# Altium schematic sheet 4-Ethernet.SchDoc: Thermocouple Temperature Logger
size A4; Date: 14.03.2026; Author: MG & JK; Revision: 1-0; SheetNumber: 4; SheetTotal: 7; Model: Rev 1.0; PageSetup: Record=PageOptions|CenterHorizontal=True|CenterVertical=True|PrintScale=0.52|XCorrection=1.00|YCorrection=1.00|PrintKind=1|BorderSize=5000000|LeftOffset=0|BottomOffset=0|Orientation=2|PaperLength=4200|PaperWidth=2970|Scale=100|PaperSource=7|PrintQuality=600|MediaType=1|DitherType=10|PaperKind=A3|PrintScaleMode=1
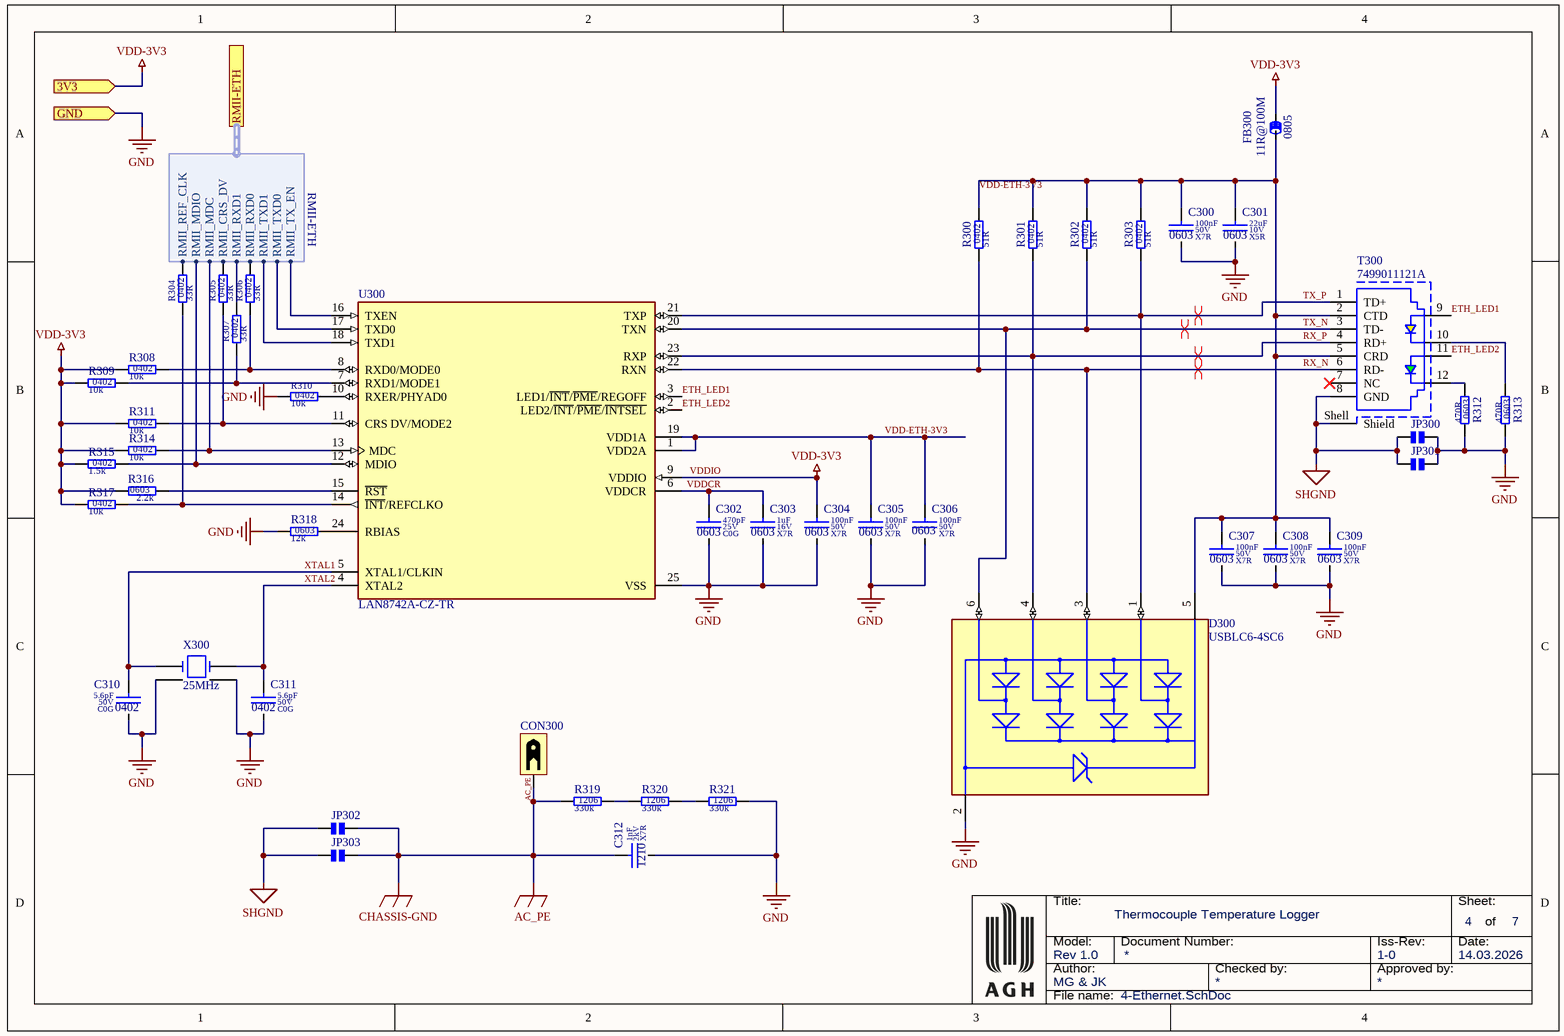
[diagram p0: 4-Ethernet.SchDoc]

## Parts
C300  value 100nF  Dielectric: X7R  Voltage: 50V  SCH_Footprint: 0603  [C_0603_1608]  (hidden comment: Ceramic X7R)
C301  value 22uF  Dielectric: X5R  Voltage: 10V  SCH_Footprint: 0603  [C_0603_1608]  (hidden comment: Ceramic X5R)
C302  value 470pF  Dielectric: C0G  Voltage: 25V  SCH_Footprint: 0603  [C_0603_1608]  (hidden comment: Ceramic C0G)
C303  value 1uF  Dielectric: X7R  Voltage: 16V  SCH_Footprint: 0603  [C_0603_1608]  (hidden comment: Ceramic X7R)
C304  value 100nF  Dielectric: X7R  Voltage: 50V  SCH_Footprint: 0603  [C_0603_1608]  (hidden comment: Ceramic X7R)
C305  value 100nF  Dielectric: X7R  Voltage: 50V  SCH_Footprint: 0603  [C_0603_1608]  (hidden comment: Ceramic X7R)
C306  value 100nF  Dielectric: X7R  Voltage: 50V  SCH_Footprint: 0603  [C_0603_1608]  (hidden comment: Ceramic X7R)
C307  value 100nF  Dielectric: X7R  Voltage: 50V  SCH_Footprint: 0603  [C_0603_1608]  (hidden comment: Ceramic X7R)
C308  value 100nF  Dielectric: X7R  Voltage: 50V  SCH_Footprint: 0603  [C_0603_1608]  (hidden comment: Ceramic X7R)
C309  value 100nF  Dielectric: X7R  Voltage: 50V  SCH_Footprint: 0603  [C_0603_1608]  (hidden comment: Ceramic X7R)
C310  value 5.6pF  Dielectric: C0G  Voltage: 50V  SCH_Footprint: 0402  [C_0402_1005]  (hidden comment: Ceramic C0G)
C311  value 5.6pF  Dielectric: C0G  Voltage: 50V  SCH_Footprint: 0402  [C_0402_1005]  (hidden comment: Ceramic C0G)
C312  value 1nF  Dielectric: X7R  Voltage: 2kV  SCH_Footprint: 1210  [C_1210_3225]  (hidden comment: Ceramic X7R)
CON300  Terminal for PE  [TP_1-726388-2]  (value not drawn)
D300  USBLC6-4SC6  [FP-SOT23-6L-MFG]
FB300  value 11R@100M  SCH_Footprint: 0805  [FB_0805_2012]  (hidden comment: Ferrite bead)
JP300  Solder Jumper 0603/1608  [JP_0603_1608]  (value not drawn)
JP301  Solder Jumper 0603/1608  [JP_0603_1608]  (value not drawn)
JP302  Solder Jumper 0603/1608  [JP_0603_1608]  (value not drawn)
JP303  Solder Jumper 0603/1608  [JP_0603_1608]  (value not drawn)
R300  value 51R  SCH_Footprint: 0402  [R_0402_1005]  (hidden comment: Resistor)
R301  value 51R  SCH_Footprint: 0402  [R_0402_1005]  (hidden comment: Resistor)
R302  value 51R  SCH_Footprint: 0402  [R_0402_1005]  (hidden comment: Resistor)
R303  value 51R  SCH_Footprint: 0402  [R_0402_1005]  (hidden comment: Resistor)
R304  value 33R  SCH_Footprint: 0402  [R_0402_1005]  (hidden comment: Resistor)
R305  value 33R  SCH_Footprint: 0402  [R_0402_1005]  (hidden comment: Resistor)
R306  value 33R  SCH_Footprint: 0402  [R_0402_1005]  (hidden comment: Resistor)
R307  value 33R  SCH_Footprint: 0402  [R_0402_1005]  (hidden comment: Resistor)
R308  value 10k  SCH_Footprint: 0402  [R_0402_1005]  (hidden comment: Resistor)
R309  value 10k  SCH_Footprint: 0402  [R_0402_1005]  (hidden comment: Resistor)
R310  value 10k  SCH_Footprint: 0402  [R_0402_1005]  (hidden comment: Resistor)
R311  value 10k  SCH_Footprint: 0402  [R_0402_1005]  (hidden comment: Resistor)
R312  value 470R  SCH_Footprint: 0603  [R_0603_1608]  (hidden comment: Resistor)
R313  value 470R  SCH_Footprint: 0603  [R_0603_1608]  (hidden comment: Resistor)
R314  value 10k  SCH_Footprint: 0402  [R_0402_1005]  (hidden comment: Resistor)
R315  value 1.5k  SCH_Footprint: 0402  [R_0402_1005]  (hidden comment: Resistor)
R316  value 2.2k  SCH_Footprint: 0603  [R_0603_1608]  (hidden comment: Resistor)
R317  value 10k  SCH_Footprint: 0402  [R_0402_1005]  (hidden comment: Resistor)
R318  value 12k  SCH_Footprint: 0603  [R_0603_1608]  (hidden comment: Resistor)
R319  value 330k  SCH_Footprint: 1206  [R_1206_3216]  (hidden comment: Resistor)
R320  value 330k  SCH_Footprint: 1206  [R_1206_3216]  (hidden comment: Resistor)
R321  value 330k  SCH_Footprint: 1206  [R_1206_3216]  (hidden comment: Resistor)
T300  7499011121A  [7499011121A]
U300  LAN8742A-CZ-TR  [FP-C04-143B-S4QFN-MFG]
X300  value 25MHz  [X_2x1.6_4PIN]  (hidden comment: 32 MHz Oscilator)

## Ports
3V3 (in, see 1-Block-diagram[4A], 2-STM32H563[2A], 3-Power-Supply[2D], 5-SD-Card[1A], 6-Connectors[1A]), GND (in, see 1-Block-diagram[4A], 2-STM32H563[2A], 3-Power-Supply[3A], 5-SD-Card[1A], 6-Connectors[1A], 7-LTC2983[1A]), RMII-ETH (harness RMII-ETH, see 1-Block-diagram[4A], 2-STM32H563[1A])

## Harnesses
RMII-ETH: RMII_TX_EN, RMII_TXD0, RMII_TXD1, RMII_RXD0, RMII_RXD1, RMII_CRS_DV, RMII_MDC, RMII_MDIO, RMII_REF_CLK

## Nets
AC_PE: C312.1 CON300.1(TP) JP302.2 JP303.2 R319.1  [also labelled CHASSIS-GND]
GND: C300.2 C301.2 C302.2 C303.2 C304.2 C305.2 C306.2 C307.2 C308.2 C309.2 C310.2 C311.2 C312.2 D300.2(GND) JP300.2 JP301.2 R310.1 R312.1 R313.1 R318.1 R321.2 U300.25(VSS) X300.2(GND) X300.4(GND) ; port GND
SHGND: JP300.1 JP301.1 JP302.1 JP303.1 T300.8(GND) T300.Shell(Shield)
VDDIO: C304.1 FB300.1 R308.1 R309.1 R311.1 R314.1 R315.1 R316.2 R317.1 U300.9(VDDIO) ; port 3V3  [also labelled VDD-3V3]
ETH_LED1: T300.9 U300.3(LED1/~{INT}/~{PME}/REGOFF)
ETH_LED2: T300.11 U300.2(LED2/~{INT}/~{PME}/~{INTSEL})
RX_N: D300.3(I/O2) R300.1 T300.6(RD-) U300.22(RXN)
RX_P: D300.4(I/O3) R301.1 T300.4(RD+) U300.23(RXP)
TX_N: D300.6(I/O4) R302.1 T300.3(TD-) U300.20(TXN)
TX_P: D300.1(I/O1) R303.1 T300.1(TD+) U300.21(TXP)
VDD-ETH-3V3: C300.1 C301.1 C305.1 C306.1 C307.1 C308.1 C309.1 D300.5(VBUS) FB300.2 R300.2 R301.2 R302.2 R303.2 T300.2(CTD) T300.5(CRD) U300.1(VDD2A) U300.19(VDD1A)
VDDCR: C302.1 C303.1 U300.6(VDDCR)
XTAL1: C310.1 U300.5(XTAL1/CLKIN) X300.3
XTAL2: C311.1 U300.4(XTAL2) X300.1
NetR304_1: R304.1 R317.2 U300.14(~{INT}/REFCLKO)
NetR304_2: R304.2 ; port RMII-ETH.RMII_REF_CLK
NetR305_1: R305.1 R311.2 U300.11(CRS_DV/MODE2)
NetR305_2: R305.2 ; port RMII-ETH.RMII_CRS_DV
NetR306_1: R306.1 R308.2 U300.8(RXD0/MODE0)
NetR306_2: R306.2 ; port RMII-ETH.RMII_RXD0
NetR307_1: R307.1 R309.2 U300.7(RXD1/MODE1)
NetR307_2: R307.2 ; port RMII-ETH.RMII_RXD1
NetR310_2: R310.2 U300.10(RXER/PHYAD0)
NetR312_2: R312.2 T300.12
NetR313_2: R313.2 T300.10
NetR314_2: R314.2 U300.13(MDC) ; port RMII-ETH.RMII_MDC
NetR315_2: R315.2 U300.12(MDIO) ; port RMII-ETH.RMII_MDIO
NetR316_1: R316.1 U300.15(~{RST})
NetR318_2: R318.2 U300.24(RBIAS)
NetR319_2: R319.2 R320.1
NetR320_2: R320.2 R321.1
NetU300_16: U300.16(TXEN) ; port RMII-ETH.RMII_TX_EN
NetU300_17: U300.17(TXD0) ; port RMII-ETH.RMII_TXD0
NetU300_18: U300.18(TXD1) ; port RMII-ETH.RMII_TXD1

Not connected (* = marked no-connect by the designer): T300 7(NC)*

## Layout directives
differential pair: RX_N, RX_P, TX_N, TX_P

## Notes on the sheet
- Title:
- Sheet:
- of
- Author:
- Model:
- Document Number:
- Checked by:
- Iss-Rev:
- Approved by:
- Date:
- File name:

## Library data of the parts
C300 C304-C309 = C_100nF_50V_X7R_0603_10_AECQ1: Capacitor; Manufacturer: Murata; Manufacturer Part Number: GCM188R71H104KA57D; Tolerance (%): 10; AEC-Q: 1; Part Number: C_100nF_50V_X7R_0603_10_AECQ1; HelpURL: https://www.murata.com/products/productdetail?partno=GCM188R71H104KA57%23; Supplier 1: TME; Supplier Part Number 1: GCM188R71H104KA57D; Supplier 2: RS Components; Supplier 3: Farnell; Supplier Part Number 3: 4360223; Supplier 4: Mouser; Supplier Part Number 4: 81-GCM188R71H104KA7D; Supplier 5: Digi-Key; Supplier Part Number 5: 490-4779-1-ND; Supplier 6: LCSC; Supplier Part Number 6: C85864
C301 = C_22uF_10V_X5R_0603_20: Capacitor; Manufacturer: Murata; Manufacturer Part Number: GRM188R61A226ME15D; Tolerance (%): 20; Part Number: C_22uF_10V_X5R_0603_20; HelpURL: https://www.mouser.pl/datasheet/2/281/1/GRM188R61A226ME15_02A-1985787.pdf; Supplier 1: TME; Supplier Part Number 1: GRM188R61A226ME15D; Supplier 2: RS Components; Supplier 3: Farnell; Supplier Part Number 3: 2426957; Supplier 4: Mouser; Supplier Part Number 4: 81-GRM188R61A226ME5D; Supplier 5: Digi-Key; Supplier Part Number 5: 490-10476-1-ND; Supplier 6: LCSC
C302 = C_470pF_25V_C0G_0603_5: Capacitor; Manufacturer: Wurth Elektronik; Manufacturer Part Number: 885012006042; Tolerance (%): 5; Part Number: C_470pF_25V_C0G_0603_5; HelpURL: https://www.we-online.com/components/products/datasheet/885012006042.pdf; Supplier 1: TME; Supplier 2: RS Components; Supplier 3: Farnell; Supplier Part Number 3: 2533843; Supplier 4: Mouser; Supplier Part Number 4: 710-885012006042; Supplier 5: Digi-Key; Supplier Part Number 5: 732-7784-1-ND; Supplier 6: LCSC
C303 = C_1uF_16V_X7R_0603_10: Capacitor; Manufacturer: Wurth Elektronik; Manufacturer Part Number: 885012206052; Tolerance (%): 10; Part Number: C_1uF_16V_X7R_0603_10; HelpURL: https://www.we-online.com/components/products/datasheet/885012206052.pdf; Supplier 1: TME; Supplier 2: RS Components; Supplier Part Number 2: 71070543; Supplier 3: Farnell; Supplier Part Number 3: 2495171; Supplier 4: Mouser; Supplier Part Number 4: 710-885012206052; Supplier 5: Digi-Key; Supplier Part Number 5: 732-7971-1-ND; Supplier 6: LCSC
C310 C311 = C_5.6pF_50V_C0G_0402_2_AECQ1: Capacitor; Manufacturer: Murata; Manufacturer Part Number: GCM1555C1H5R6BA16D; Tolerance (%): 2; AEC-Q: 1; Part Number: C_5.6pF_50V_C0G_0402_2_AECQ1; HelpURL: https://www.murata.com/products/productdetail?partno=GCM1555C1H5R6BA16%23; Supplier 1: TME; Supplier Part Number 1: GCM1555C1H5R6BA16D; Supplier 2: RS Components; Supplier 3: Farnell; Supplier Part Number 3: 3581200; Supplier 4: Mouser; Supplier Part Number 4: 81-GCM1555C1H5R6BA6D; Supplier 5: Digi-Key; Supplier Part Number 5: 490-14424-1-ND; Supplier 6: LCSC; Supplier Part Number 6: C415376
C312 = C_1nF_2kV_X7R_1210_10: Capacitor; Manufacturer: AVX; Manufacturer Part Number: 1210GC102KAT1A; Tolerance (%): 10; Part Number: C_1nF_2kV_X7R_1210_10; HelpURL: http://www.tme.eu/pl/Document/667fe6e7748c0ed1675574c6bf64b751/AVX_X7R.pdf; Supplier 1: TME; Supplier Part Number 1: 1210GC102KAT1A; Supplier 2: RS Components; Supplier 3: Farnell; Supplier 4: Mouser; Supplier 5: Digi-Key; Supplier 6: LCSC
CON300 = TP_TERMINAL_1-726388-2: Terminal; Manufacturer: TE Connectivity; SCH_Footprint: THT; Value: 1-726388-2; Part Number: TP_TERMINAL_1-726388-2; HelpURL: https://datasheet.octopart.com/1-726388-2-TE-Connectivity-datasheet-13534909.pdf; Manufacturer Part Number: 1-726388-2; Supplier 1: TME; Supplier Part Number 1: 1-726388-2; Supplier 2: RS Components; Supplier Part Number 2: 6805772; Supplier 3: Farnell; Supplier Part Number 3: 2308760; Supplier 4: Mouser; Supplier Part Number 4: 571-1-726388-2; Supplier 5: Digi-Key; Supplier Part Number 5: 1-726388-2-ND; Supplier 6: LCSC
D300 = CMP-2000-07370-2: TVS DIODE 5.25V 17V SOT23-6; Manufacturer: STMicroelectronics; Peak Pulse Power: 130W; Breakdown Voltage: 6V; Value: 3pF; Direction: Unidirectional; Interface: USB,Ethernet,Other; Number Of Channels: 4; Standoff Height: 0mm; Max Junction Temp: +125°C; Digikey Description: TVS DIODE 5.25V 17V SOT23-6; Automotive: No; Package: SOT23-6L; Mouser Description: USBLC6 Series 4 Line 6 V Uni / Bi-Directional ESD Protection - SOT-23-6; Octopart: https://octopart.com/usblc6-4sc6-stmicroelectronics-347147; RoHS: TRUE; ComponentLink2URL: https://upverter.com/datasheet/23dc4ffb028d868909e80577610284b194f13213.pdf; ComponentLink2Description: Datasheet; Device Class L1: Circuit Protection; Lead Free: Yes; Temperature Range High: +125°C; Device Class L2: ESD and Circuit Protection ICs; Device Class L3: unset; Capacitance: 3pF; Height: 1.45mm; Temperature Range Low: -40°C; Manufacturer Part Number: USBLC6-4SC6; Temperature: -40°C to +125°C; Category: Diode; Clamping Voltage: 17V
FB300 = FB_2508051107Y0: Manufacturer: Fair-Rite; Current: 300mA; Resistance: 100mR; Part Number: FB_2508051107Y0; HelpURL: https://datasheet.octopart.com/2508051107Y0-Fair-Rite-datasheet-834.pdf; Manufacturer Part Number: 2508051107Y0; Supplier 1: TME; Supplier 2: RS Components; Supplier 3: Farnell; Supplier Part Number 3: 1612004; Supplier 4: Mouser; Supplier Part Number 4: 623-2508051107Y0; Supplier 5: Digi-Key; Supplier Part Number 5: 1934-1397-1-ND; Supplier 6: LCSC
JP300-JP303 = JP_0603_1608: SCH_Footprint: 0603; Value: -; Part Number: JP_0603_1608; HelpURL: -; Manufacturer: -; Manufacturer Part Number: -; Supplier 1: TME; Supplier 2: RS Components; Supplier 3: Farnell; Supplier 4: Mouser; Supplier 5: Digi-Key; Supplier 6: LCSC
R300-R303 = R_51R_0402_1_AECQ0: Manufacturer: Panasonic; Manufacturer Part Number: ERJ-2RKF51R0X; Voltage: 50V; Power: 100mW; Tolerance: 1%; AEC-Q: 0; Part Number: R_51R_0402_1_AECQ0; HelpURL: https://industrial.panasonic.com/cdbs/www-data/pdf/RDA0000/AOA0000C304.pdf; Supplier 1: TME; Supplier Part Number 1: ERJ2RKF51R0X; Supplier 2: RS Components; Supplier 3: Farnell; Supplier Part Number 3: 2302492; Supplier 4: Mouser; Supplier Part Number 4: 667-ERJ-2RKF51R0X; Supplier 5: Digi-Key; Supplier Part Number 5: P51.0LCT-ND; Supplier 6: LCSC
R304-R307 = R_33R_0402_1_AECQ0: Manufacturer: Panasonic; Manufacturer Part Number: ERJ-2RKF33R0X; Voltage: 50V; Power: 100mW; Tolerance: 1%; AEC-Q: 0; Part Number: R_33R_0402_1_AECQ0; HelpURL: https://industrial.panasonic.com/cdbs/www-data/pdf/RDA0000/AOA0000C304.pdf; Supplier 1: TME; Supplier Part Number 1: ERJ2RKF33R0X; Supplier 2: RS Components; Supplier 3: Farnell; Supplier Part Number 3: 2302472; Supplier 4: Mouser; Supplier Part Number 4: 667-ERJ-2RKF33R0X; Supplier 5: Digi-Key; Supplier Part Number 5: P33.0LCT-ND; Supplier 6: LCSC; Supplier Part Number 6: C278594
R308-R311 R314 R317 = R_10k_0402_1: Manufacturer: Yageo; Manufacturer Part Number: RC0402FR-0710KL; Voltage: 50V; Power: 63mW; Tolerance: 1%; Part Number: R_10k_0402_1; HelpURL: http://www.tme.eu/pl/Document/1a2bc76e2be68b3b1670068306778ce6/rc0402yageo.pdf; Supplier 1: TME; Supplier Part Number 1: RC0402FR-0710K; Supplier 2: RS Components; Supplier 3: Farnell; Supplier 4: Mouser; Supplier 5: Digi-Key; Supplier 6: LCSC
R312 R313 = R_470R_0603_1: Manufacturer: Yageo; Manufacturer Part Number: RC0603FR-07470RL; Voltage: 50V; Power: 100mW; Tolerance: 1%; Part Number: R_470R_0603_1; HelpURL: http://www.tme.eu/en/Document/9fef8ccbb584e9f6a1c931cf356afd5c/PYu-RC0603_51_RoHS_L_4.pdf; Supplier 1: TME; Supplier Part Number 1: RC0603FR-07470R; Supplier 2: RS Components; Supplier 3: Farnell; Supplier Part Number 3: 9238441; Supplier 4: Mouser; Supplier Part Number 4: 603-RC0603FR-07470RL; Supplier 5: Digi-Key; Supplier Part Number 5: 311-470HRCT-ND; Supplier 6: LCSC
R315 = R_1.5k_0402_1_AECQ0: Manufacturer: Panasonic; Manufacturer Part Number: ERJ-2RKF1501X; Voltage: 50V; Power: 100mW; Tolerance: 1%; AEC-Q: 0; Part Number: R_1.5k_0402_1_AECQ0; HelpURL: https://industrial.panasonic.com/cdbs/www-data/pdf/RDA0000/AOA0000C304.pdf; Supplier 1: TME; Supplier Part Number 1: ERJ2RKF1501X; Supplier 2: RS Components; Supplier 3: Farnell; Supplier Part Number 3: 2302656; Supplier 4: Mouser; Supplier Part Number 4: 667-ERJ-2RKF1501X; Supplier 5: Digi-Key; Supplier Part Number 5: P1.50KLCT-ND; Supplier 6: LCSC
R316 = R_2.2k_0603_1: Manufacturer: Yageo; Manufacturer Part Number: RC0603FR-072K2L; Voltage: 50V; Power: 100mW; Tolerance: 1%; Part Number: R_2.2k_0603_1; HelpURL: https://datasheet.octopart.com/RC0603FR-072K2L-Yageo-datasheet-8328172.pdf; Supplier 1: TME; Supplier Part Number 1: RC0603FR-072K2; Supplier 2: RS Components; Supplier 3: Farnell; Supplier Part Number 3: 9238522; Supplier 4: Mouser; Supplier Part Number 4: 603-RC0603FR-072K2L; Supplier 5: Digi-Key; Supplier Part Number 5: 311-2.20KHRCT-ND; Supplier 6: LCSC
R318 = R_12k_0603_1: Manufacturer: Yageo; Manufacturer Part Number: RC0603FR-0712KL; Voltage: 50V; Power: 100mW; Tolerance: 1%; Part Number: R_12k_0603_1; HelpURL: http://www.tme.eu/pl/Document/d2a72e545e5c8eb7bf2a04fa97535928/rc0603yageo.pdf; Supplier 1: TME; Supplier Part Number 1: RC0603FR-0712K; Supplier 2: RS Components; Supplier 3: Farnell; Supplier Part Number 3: 2693657; Supplier 4: Mouser; Supplier Part Number 4: 603-RC0603FR-0712KL; Supplier 5: Digi-Key; Supplier Part Number 5: 311-12.0KHRCT-ND; Supplier 6: LCSC
R319-R321 = R_330k_1206_1: Manufacturer: Yageo; Manufacturer Part Number: RC1206FR-07330KL; Voltage: 200V; Power: 250mW; Tolerance: 1%; Part Number: R_330k_1206_1; HelpURL: https://datasheet.octopart.com/RC1206FR-07330KL-Yageo-datasheet-8359522.pdf; Supplier 1: TME; Supplier Part Number 1: RC1206FR-07330KL; Supplier 2: RS Components; Supplier Part Number 2: 1995833; Supplier 3: Farnell; Supplier Part Number 3: 9241094; Supplier 4: Mouser; Supplier Part Number 4: 603-RC1206FR-07330KL; Supplier 5: Digi-Key; Supplier Part Number 5: 311-330KFRCT-ND; Supplier 6: LCSC
T300 = 7499011121A: WE-RJ45 LAN Transformer, THT, 10/100 Base-T, Tab Down, 1 Port; Manufacturer: Wurth Elektronik; LED: yellow-green; Number of Ports: 1; PoE: non-PoE; Shield Tabs: Yes; USB: No USB; Manufacturer Part Number: 7499011121A; Category: Filtered Connectors; Match Code: WE-RJ45 LAN; ComponentLink1Description: Website Link; ComponentLink1URL: https://www.we-online.com/redexpert/article/7499011121A?ad; ComponentLink2Description: Datasheet Link; ComponentLink2URL: https://www.we-online.com/redexpert/spec/7499011121A?ad; Mount: Through Hole; Min Operating Temperature: -40°C; Max Operating Temperature: 85°C; Packaging: Tube; Length: 21.84mm; Width: 15.88mm; Height: 13.74mm; Data Rate: 10/100 Base-T; Tab: Down
U300 = CMP-06281-000006-2: IC TRANSCEIVER 1/1 24SQFN; Manufacturer: Microchip; Nominal Supply Current: 6.5-59mA; Max Supply Voltage: 3.6V; Number Of Channels: 1; Data Rate: 100Mbits/s; Interface: Ethernet,Other; Min Supply Voltage: 1.14V; Standoff Height: 0mm; Simplex Duplex: Full-Duplex; Height: 1mm; Ambient Temperature Range High: +70°C; Category: IC; Mouser Description: Small Footprint RMII 10/100 Ethernet Transceiver with flexPWR Technology; Manufacturer Part Number: LAN8742A-CZ-TR; Digikey Description: IC TRANSCEIVER 1/1 24SQFN; Octopart: https://octopart.com/lan8742a-cz-tr-microchip-29030587; Temperature: 0°C to +70°C; Ambient Temperature Range Low: 0°C; Temperature Range Low: 0°C; ComponentLink2Description: Datasheet; Automotive: No; RoHS: TRUE; Device Class L3: Ethernet Interface ICs; Device Class L1: Integrated Circuits (ICs); Device Class L2: Interface ICs; Lead Free: Yes; Ipc Land Pattern Name: QFN50P400X400X90-24; ComponentLink2URL: http://ww1.microchip.com/downloads/en/DeviceDoc/DS_LAN8742_00001989A.pdf; Temperature Range High: +70°C; Package: C04-143B-S4QFN
X300 = X_NX2016SA-32M-EXS00A-CS06465: Part Number: NX2016SA-25.000M-STD-CZS-1; Manufacturer: NDK; SCH_Footprint: x1.6; Manufacturer Part Number: NX2016SA-25.000M-STD-CZS-1; HelpURL: https://pl.mouser.com/datasheet/2/905/ndk_08142018_NX2016SA-32M-EXS00A-CS06465_SS-1389053.pdf; Supplier 1: TME; Supplier 2: RS Components; Supplier 3: Farnell; Supplier 4: Mouser; Supplier Part Number 4: 344-NX2016SA32S06465; Supplier 5: Digi-Key; Supplier Part Number 5: 644-1300-1-ND; Supplier 6: LCSC